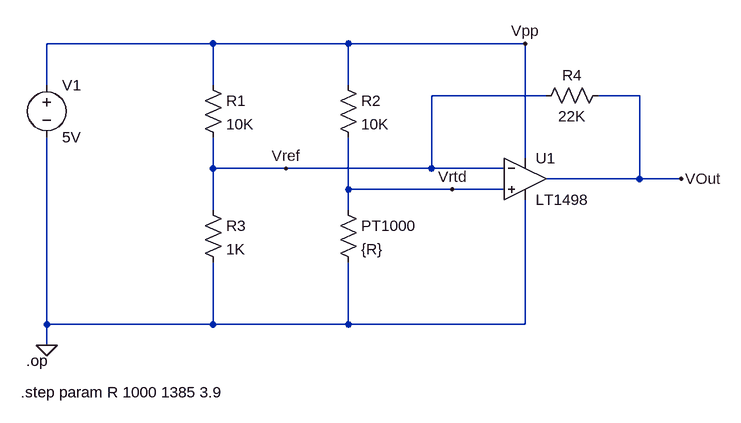
[diagram p0: schematic rtd_jm_sim_amp_rtd_Voltage_Divider_wAmp.asc]
rtd_jm_sim_amp_rtd_Voltage_Divider_wAmp.asc, the LTspice schematic file:
Version 4
SHEET 1 880 680
WIRE -272 64 -528 64
WIRE -64 64 -272 64
WIRE 208 64 -64 64
WIRE -528 128 -528 64
WIRE -272 128 -272 64
WIRE -64 128 -64 64
WIRE 240 144 64 144
WIRE 384 144 320 144
WIRE 208 240 208 64
WIRE -272 256 -272 208
WIRE -160 256 -272 256
WIRE 64 256 64 144
WIRE 64 256 -160 256
WIRE 176 256 64 256
WIRE 384 272 384 144
WIRE 384 272 240 272
WIRE 448 272 384 272
WIRE -64 288 -64 208
WIRE 96 288 -64 288
WIRE 176 288 96 288
WIRE -272 320 -272 256
WIRE -64 320 -64 288
WIRE -528 496 -528 208
WIRE -272 496 -272 400
WIRE -272 496 -528 496
WIRE -64 496 -64 400
WIRE -64 496 -272 496
WIRE 208 496 208 304
WIRE 208 496 -64 496
WIRE -528 528 -528 496
FLAG -528 528 0
FLAG 448 272 VOut
FLAG 208 64 Vpp
FLAG -160 256 Vref
FLAG 96 288 Vrtd
SYMBOL Opamps\\LT1498 208 208 R0
SYMATTR InstName U1
SYMBOL voltage -528 112 R0
WINDOW 123 0 0 Left 0
WINDOW 39 0 0 Left 0
SYMATTR InstName V1
SYMATTR Value 5V
SYMBOL res -288 112 R0
SYMATTR InstName R1
SYMATTR Value 10K
SYMBOL res -80 112 R0
SYMATTR InstName R2
SYMATTR Value 10K
SYMBOL res -288 304 R0
SYMATTR InstName R3
SYMATTR Value 1K
SYMBOL res -80 304 R0
SYMATTR InstName PT1000
SYMATTR Value {R}
SYMBOL res 336 128 R90
WINDOW 0 0 56 VBottom 2
WINDOW 3 32 56 VTop 2
SYMATTR InstName R4
SYMATTR Value 22K
TEXT -560 552 Left 2 !.op
TEXT -568 600 Left 2 !.step param R 1000 1385 3.9

The netlist it stands for:
* rtd_jm_sim_amp_rtd_Voltage_Divider_wAmp.asc
XU1 Vrtd Vref Vpp 0 VOut LT1498  ; pins In+ In- V+ V- OUT
V1 Vpp 0 5V
R1 Vpp Vref 10K
R2 Vpp Vrtd 10K
R3 Vref 0 1K
R§PT1000 Vrtd 0 {R}
R4 VOut Vref 22K
.op
.step param R 1000 1385 3.9
.lib LTC.lib
.backanno
.end